# Altium schematic sheet microcontroller.SchDoc
size B
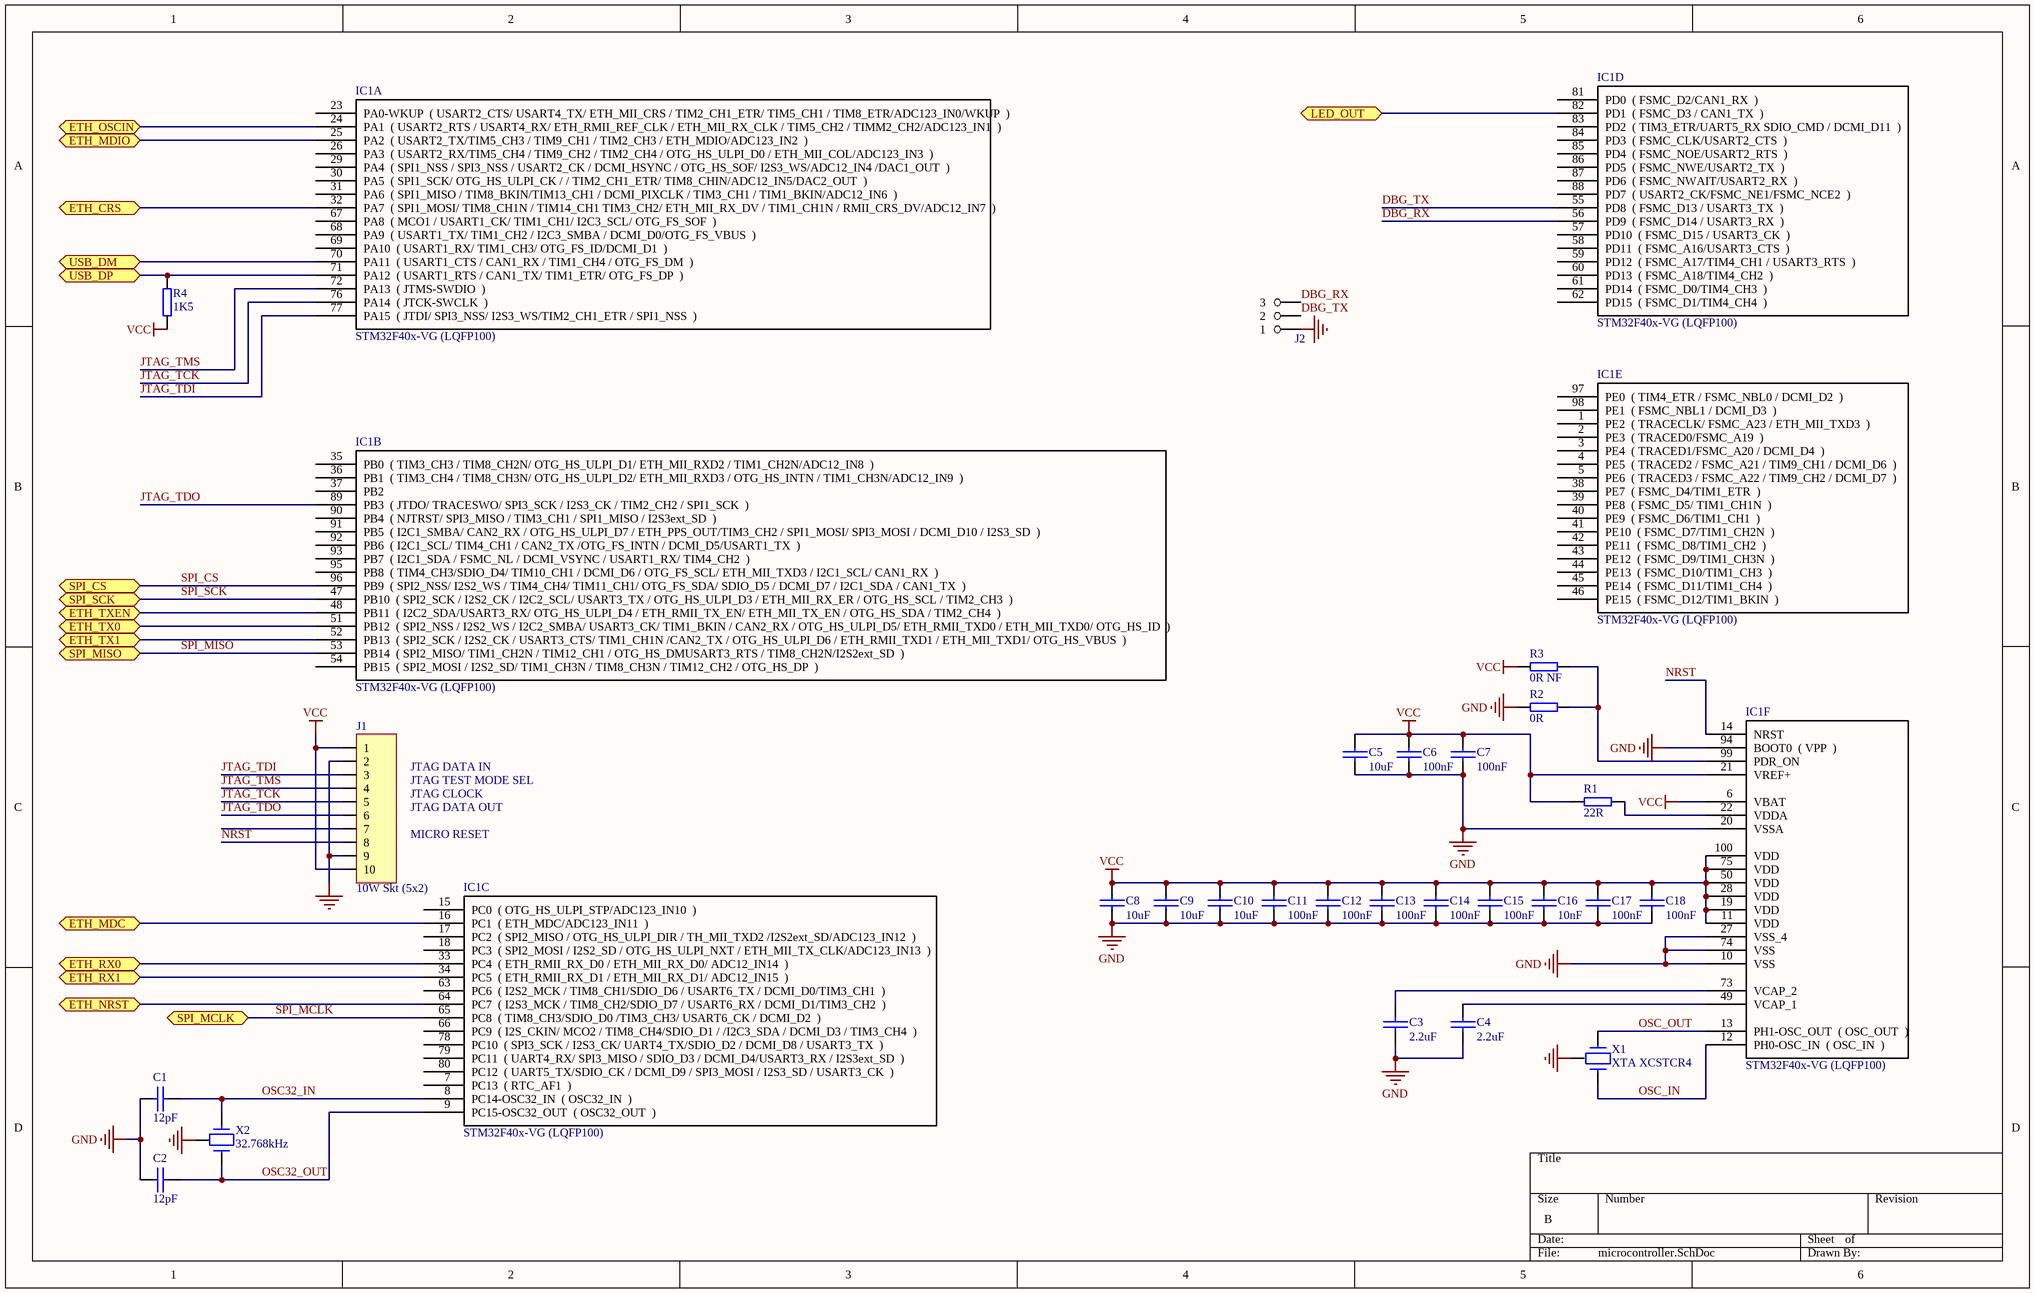
[diagram p0: microcontroller.SchDoc]

## Parts
C1  12pF  [0603-IPC]
C2  12pF  [0603-IPC]
C3  2.2uF  [0603-IPC]
C4  2.2uF  [0603-IPC]
C5  10uF  [0603-IPC]
C6  100nF  [0603-IPC]
C7  100nF  [0603-IPC]
C8  10uF  [0603-IPC]
C9  10uF  [0603-IPC]
C10  10uF  [0603-IPC]
C11  100nF  [0603-IPC]
C12  100nF  [0603-IPC]
C13  100nF  [0603-IPC]
C14  100nF  [0603-IPC]
C15  100nF  [0603-IPC]
C16  10nF  [0603-IPC]
C17  100nF  [0603-IPC]
C18  100nF  [0603-IPC]
IC1  STM32F40x-VG (LQFP100)  [TQFP100_N]  (parts A,B,C,D,E,F of 6)
J1  10W Skt (5x2)  [CON 10W 2mm IDC SKT]
J2  Jumper 3W  [Jumper 2.54mm Pitch 3W]  (value not drawn)
R1  22R  [0603-IPC]
R2  0R  [0603-IPC]
R3  0R NF  [0603-IPC]
R4  1K5  [0603-IPC]
X1  XTA XCSTCR4  [XTA CSTCEXXX]
X2  32.768kHz  [X3-308]

## Ports
ETH_CRS (bidir), ETH_MDC (bidir), ETH_MDIO (bidir), ETH_NRST (bidir), ETH_OSCIN (bidir), ETH_RX0 (bidir), ETH_RX1 (bidir), ETH_TX0 (bidir), ETH_TX1 (bidir), ETH_TXEN (bidir), LED_OUT (bidir), SPI_CS (bidir), SPI_MCLK (bidir), SPI_MISO (bidir), SPI_SCK (bidir), USB_DM (bidir), USB_DP (bidir)

## Nets
GND: C1.1 C2.1 C3.1 C4.1 C5.1 C6.1 C7.1 C8.1 C9.1 C10.1 C11.1 C12.1 C13.1 C14.1 C15.1 C16.1 C17.1 C18.1 IC1.10(VSS) IC1.20(VSSA) IC1.27(VSS_4) IC1.74(VSS) IC1.94(BOOT0__(_VPP__)) J1.2 J1.9 J2.1 R2.2 X1.2 X2.3
VCC: C5.2 C6.2 C7.2 C8.2 C9.2 C10.2 C11.2 C12.2 C13.2 C14.2 C15.2 C16.2 C17.2 C18.2 IC1.6(VBAT) IC1.11(VDD) IC1.19(VDD) IC1.21(VREF+) IC1.28(VDD) IC1.50(VDD) IC1.75(VDD) IC1.100(VDD) J1.1 J1.10 R1.2 R3.2 R4.2
DBG_RX: IC1.56(PD9__(_FSMC_D14_/_USART3_RX__)) J2.3
DBG_TX: IC1.55(PD8__(_FSMC_D13_/_USART3_TX__)) J2.2
ETH_CRS: IC1.32(PA7__(_SPI1_MOSI/_TIM8_CH1N_/_TIM14_CH1_TIM3_CH2/_ETH_MII_RX_DV_/_TIM1_CH1N_/_RMII_CRS_DV/ADC12_IN7__)) ; port ETH_CRS
ETH_MDC: IC1.16(PC1__(_ETH_MDC/ADC123_IN11__)) ; port ETH_MDC
ETH_MDIO: IC1.25(PA2__(_USART2_TX/TIM5_CH3_/_TIM9_CH1_/_TIM2_CH3_/_ETH_MDIO/ADC123_IN2__)) ; port ETH_MDIO
ETH_NRST: IC1.64(PC7__(_I2S3_MCK_/_TIM8_CH2/SDIO_D7_/_USART6_RX_/_DCMI_D1/TIM3_CH2__)) ; port ETH_NRST
ETH_OSCIN: IC1.24(PA1__(_USART2_RTS_/_USART4_RX/_ETH_RMII_REF_CLK_/_ETH_MII_RX_CLK_/_TIM5_CH2_/_TIMM2_CH2/ADC123_IN1__)) ; port ETH_OSCIN
ETH_RX0: IC1.33(PC4__(_ETH_RMII_RX_D0_/_ETH_MII_RX_D0/_ADC12_IN14__)) ; port ETH_RX0
ETH_RX1: IC1.34(PC5__(_ETH_RMII_RX_D1_/_ETH_MII_RX_D1/_ADC12_IN15__)) ; port ETH_RX1
ETH_TX0: IC1.51(PB12__(_SPI2_NSS_/_I2S2_WS_/_I2C2_SMBA/_USART3_CK/_TIM1_BKIN_/_CAN2_RX_/_OTG_HS_ULPI_D5/_ETH_RMII_TXD0_/_ETH_MII_TXD0/_OTG_HS_ID__)) ; port ETH_TX0
ETH_TX1: IC1.52(PB13__(_SPI2_SCK_/_I2S2_CK_/_USART3_CTS/_TIM1_CH1N_/CAN2_TX_/_OTG_HS_ULPI_D6_/_ETH_RMII_TXD1_/_ETH_MII_TXD1/_OTG_HS_VBUS__)) ; port ETH_TX1
ETH_TXEN: IC1.48(PB11__(_I2C2_SDA/USART3_RX/_OTG_HS_ULPI_D4_/_ETH_RMII_TX_EN/_ETH_MII_TX_EN_/_OTG_HS_SDA_/_TIM2_CH4__)) ; port ETH_TXEN
JTAG_TCK: IC1.76(PA14__(_JTCK-SWCLK__)) J1.5
JTAG_TDI: IC1.77(PA15__(_JTDI/_SPI3_NSS/_I2S3_WS/TIM2_CH1_ETR_/_SPI1_NSS__)) J1.3
JTAG_TDO: IC1.89(PB3__(_JTDO/_TRACESWO/_SPI3_SCK_/_I2S3_CK_/_TIM2_CH2_/_SPI1_SCK__)) J1.6
JTAG_TMS: IC1.72(PA13__(_JTMS-SWDIO__)) J1.4
LED_OUT: IC1.82(PD1__(_FSMC_D3_/_CAN1_TX__)) ; port LED_OUT
NRST: IC1.14(NRST) J1.8
OSC32_IN: C1.2 IC1.8(PC14-OSC32_IN__(_OSC32_IN__)) X2.2
OSC32_OUT: C2.2 IC1.9(PC15-OSC32_OUT__(_OSC32_OUT__)) X2.1
OSC_IN: IC1.12(PH0-OSC_IN__(_OSC_IN__)) X1.3
OSC_OUT: IC1.13(PH1-OSC_OUT__(_OSC_OUT__)) X1.1
SPI_CS: IC1.96(PB9__(_SPI2_NSS/_I2S2_WS_/_TIM4_CH4/_TIM11_CH1/_OTG_FS_SDA/_SDIO_D5_/_DCMI_D7_/_I2C1_SDA_/_CAN1_TX__)) ; port SPI_CS
SPI_MCLK: IC1.65(PC8__(_TIM8_CH3/SDIO_D0_/TIM3_CH3/_USART6_CK_/_DCMI_D2__)) ; port SPI_MCLK
SPI_MISO: IC1.53(PB14__(_SPI2_MISO/_TIM1_CH2N_/_TIM12_CH1_/_OTG_HS_DMUSART3_RTS_/_TIM8_CH2N/I2S2ext_SD__)) ; port SPI_MISO
SPI_SCK: IC1.47(PB10__(_SPI2_SCK_/_I2S2_CK_/_I2C2_SCL/_USART3_TX_/_OTG_HS_ULPI_D3_/_ETH_MII_RX_ER_/_OTG_HS_SCL_/_TIM2_CH3__)) ; port SPI_SCK
USB_DM: IC1.70(PA11__(_USART1_CTS_/_CAN1_RX_/_TIM1_CH4_/_OTG_FS_DM__)) ; port USB_DM
USB_DP: IC1.71(PA12__(_USART1_RTS_/_CAN1_TX/_TIM1_ETR/_OTG_FS_DP__)) R4.1 ; port USB_DP
NetC3_2: C3.2 IC1.73(VCAP_2)
NetC4_2: C4.2 IC1.49(VCAP_1)
NetIC1_22: IC1.22(VDDA) R1.1
NetIC1_99: IC1.99(PDR_ON) R2.1 R3.1

Not connected (* = marked no-connect by the designer): IC1 1(PE2__(_TRACECLK/_FSMC_A23_/_ETH_MII_TXD3__)) 2(PE3__(_TRACED0/FSMC_A19__)) 3(PE4__(_TRACED1/FSMC_A20_/_DCMI_D4__)) 4(PE5__(_TRACED2_/_FSMC_A21_/_TIM9_CH1_/_DCMI_D6__)) 5(PE6__(_TRACED3_/_FSMC_A22_/_TIM9_CH2_/_DCMI_D7__)) 7(PC13__(_RTC_AF1__)) 15(PC0__(_OTG_HS_ULPI_STP/ADC123_IN10__)) 17(PC2__(_SPI2_MISO_/_OTG_HS_ULPI_DIR_/_TH_MII_TXD2_/I2S2ext_SD/ADC123_IN12__)) 18(PC3__(_SPI2_MOSI_/_I2S2_SD_/_OTG_HS_ULPI_NXT_/_ETH_MII_TX_CLK/ADC123_IN13__)) 23(PA0-WKUP__(_USART2_CTS/_USART4_TX/_ETH_MII_CRS_/_TIM2_CH1_ETR/_TIM5_CH1_/_TIM8_ETR/ADC123_IN0/WKUP__)) 26(PA3__(_USART2_RX/TIM5_CH4_/_TIM9_CH2_/_TIM2_CH4_/_OTG_HS_ULPI_D0_/_ETH_MII_COL/ADC123_IN3__)) 29(PA4__(_SPI1_NSS_/_SPI3_NSS_/_USART2_CK_/_DCMI_HSYNC_/_OTG_HS_SOF/_I2S3_WS/ADC12_IN4_/DAC1_OUT__)) 30(PA5__(_SPI1_SCK/_OTG_HS_ULPI_CK_/_/_TIM2_CH1_ETR/_TIM8_CHIN/ADC12_IN5/DAC2_OUT__)) 31(PA6__(_SPI1_MISO_/_TIM8_BKIN/TIM13_CH1_/_DCMI_PIXCLK_/_TIM3_CH1_/_TIM1_BKIN/ADC12_IN6__)) 35(PB0__(_TIM3_CH3_/_TIM8_CH2N/_OTG_HS_ULPI_D1/_ETH_MII_RXD2_/_TIM1_CH2N/ADC12_IN8__)) 36(PB1__(_TIM3_CH4_/_TIM8_CH3N/_OTG_HS_ULPI_D2/_ETH_MII_RXD3_/_OTG_HS_INTN_/_TIM1_CH3N/ADC12_IN9__)) 37(PB2) 38(PE7__(_FSMC_D4/TIM1_ETR__)) 39(PE8__(_FSMC_D5/_TIM1_CH1N__)) 40(PE9__(_FSMC_D6/TIM1_CH1__)) 41(PE10__(_FSMC_D7/TIM1_CH2N__)) 42(PE11__(_FSMC_D8/TIM1_CH2__)) 43(PE12__(_FSMC_D9/TIM1_CH3N__)) 44(PE13__(_FSMC_D10/TIM1_CH3__)) 45(PE14__(_FSMC_D11/TIM1_CH4__)) 46(PE15__(_FSMC_D12/TIM1_BKIN__)) 54(PB15__(_SPI2_MOSI_/_I2S2_SD/_TIM1_CH3N_/_TIM8_CH3N_/_TIM12_CH2_/_OTG_HS_DP__)) 57(PD10__(_FSMC_D15_/_USART3_CK__)) 58(PD11__(_FSMC_A16/USART3_CTS__)) 59(PD12__(_FSMC_A17/TIM4_CH1_/_USART3_RTS__)) 60(PD13__(_FSMC_A18/TIM4_CH2__)) 61(PD14__(_FSMC_D0/TIM4_CH3__)) 62(PD15__(_FSMC_D1/TIM4_CH4__)) 63(PC6__(_I2S2_MCK_/_TIM8_CH1/SDIO_D6_/_USART6_TX_/_DCMI_D0/TIM3_CH1__)) 66(PC9__(_I2S_CKIN/_MCO2_/_TIM8_CH4/SDIO_D1_/_/I2C3_SDA_/_DCMI_D3_/_TIM3_CH4__)) 67(PA8__(_MCO1_/_USART1_CK/_TIM1_CH1/_I2C3_SCL/_OTG_FS_SOF__)) 68(PA9__(_USART1_TX/_TIM1_CH2_/_I2C3_SMBA_/_DCMI_D0/OTG_FS_VBUS__)) 69(PA10__(_USART1_RX/_TIM1_CH3/_OTG_FS_ID/DCMI_D1__)) 78(PC10__(_SPI3_SCK_/_I2S3_CK/_UART4_TX/SDIO_D2_/_DCMI_D8_/_USART3_TX__)) 79(PC11__(_UART4_RX/_SPI3_MISO_/_SDIO_D3_/_DCMI_D4/USART3_RX_/_I2S3ext_SD__)) 80(PC12__(_UART5_TX/SDIO_CK_/_DCMI_D9_/_SPI3_MOSI_/_I2S3_SD_/_USART3_CK__)) 81(PD0__(_FSMC_D2/CAN1_RX__)) 83(PD2__(_TIM3_ETR/UART5_RX_SDIO_CMD_/_DCMI_D11__)) 84(PD3__(_FSMC_CLK/USART2_CTS__)) 85(PD4__(_FSMC_NOE/USART2_RTS__)) 86(PD5__(_FSMC_NWE/USART2_TX__)) 87(PD6__(_FSMC_NWAIT/USART2_RX__)) 88(PD7__(_USART2_CK/FSMC_NE1/FSMC_NCE2__)) 90(PB4__(_NJTRST/_SPI3_MISO_/_TIM3_CH1_/_SPI1_MISO_/_I2S3ext_SD__)) 91(PB5__(_I2C1_SMBA/_CAN2_RX_/_OTG_HS_ULPI_D7_/_ETH_PPS_OUT/TIM3_CH2_/_SPI1_MOSI/_SPI3_MOSI_/_DCMI_D10_/_I2S3_SD__)) 92(PB6__(_I2C1_SCL/_TIM4_CH1_/_CAN2_TX_/OTG_FS_INTN_/_DCMI_D5/USART1_TX__)) 93(PB7__(_I2C1_SDA_/_FSMC_NL_/_DCMI_VSYNC_/_USART1_RX/_TIM4_CH2__)) 95(PB8__(_TIM4_CH3/SDIO_D4/_TIM10_CH1_/_DCMI_D6_/_OTG_FS_SCL/_ETH_MII_TXD3_/_I2C1_SCL/_CAN1_RX__)) 97(PE0__(_TIM4_ETR_/_FSMC_NBL0_/_DCMI_D2__)) 98(PE1__(_FSMC_NBL1_/_DCMI_D3__)); J1 7

## Notes on the sheet
- JTAG DATA IN
- MICRO RESET
- JTAG DATA OUT
- JTAG CLOCK
- JTAG TEST MODE SEL

## Library data of the parts
C1-C18 = CAP 0603 XXX: 0.01uF 50V
IC1 = STM32F40x-VG
J1 = CON 10W RECEPT 2mm: CON 10W(2x5) SKT 2mm Vert H4.5mm; Manufacturer P/N: M22-6340542; Manufacturer: Harwin; Rows: Dual; Technology: SMD; Value: 10W Skt (5x2); Orientation: Vertical; Pitch: 2mm; Height: 4.5mm; Supplier 1: Digi-Key; Supplier Part Number 1: 952-1347-5-ND
J2 = Jumper 3W: 3W Jumper Pitch 2.54mm
R1-R4 = RES 0603 XXX: RES0603
X1 = XTA CSTCEXXX: Murata Crystal Resonator 3.2mm x 1.3mm
X2 = XTA 32.768kHz 6.2 x 02.1MM CYLINDER: 32.768kHz Crystal 6.2 x 02.1MM CYLINDER